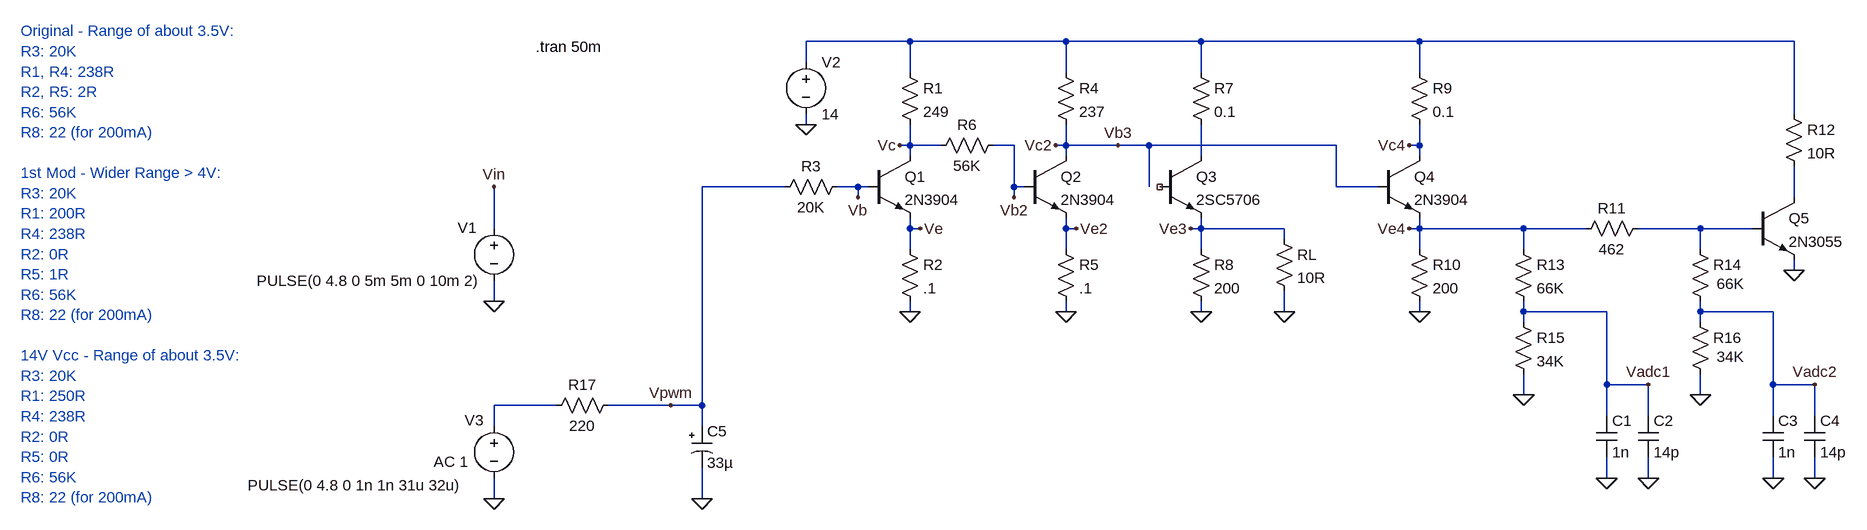
[diagram p0: schematic 2N3904 DC Amplifier - Base Driver.asc]
2N3904 DC Amplifier - Base Driver.asc, the LTspice schematic file:
Version 4
SHEET 1 2760 680
WIRE 192 -48 32 -48
WIRE 432 -48 192 -48
WIRE 640 -48 432 -48
WIRE 976 -48 640 -48
WIRE 1552 -48 976 -48
WIRE 32 -16 32 -48
WIRE 192 0 192 -48
WIRE 432 0 432 -48
WIRE 640 0 640 -48
WIRE 976 0 976 -48
WIRE 1552 64 1552 -48
WIRE 32 80 32 64
WIRE 192 112 192 80
WIRE 192 112 176 112
WIRE 240 112 192 112
WIRE 352 112 320 112
WIRE 432 112 432 80
WIRE 432 112 416 112
WIRE 512 112 432 112
WIRE 560 112 512 112
WIRE 848 112 560 112
WIRE 976 112 976 80
WIRE 976 112 960 112
WIRE 192 128 192 112
WIRE 432 128 432 112
WIRE 640 128 640 80
WIRE 976 128 976 112
WIRE 0 176 -128 176
WIRE 112 176 80 176
WIRE 128 176 112 176
WIRE 352 176 352 112
WIRE 368 176 352 176
WIRE 560 176 560 112
WIRE 848 176 848 112
WIRE 912 176 848 176
WIRE 112 192 112 176
WIRE 352 192 352 176
WIRE 1552 192 1552 144
WIRE -448 240 -448 176
WIRE 192 240 192 224
WIRE 208 240 192 240
WIRE 432 240 432 224
WIRE 448 240 432 240
WIRE 640 240 640 224
WIRE 640 240 624 240
WIRE 768 240 640 240
WIRE 976 240 976 224
WIRE 976 240 960 240
WIRE 1136 240 976 240
WIRE 1232 240 1136 240
WIRE 1408 240 1312 240
WIRE 1488 240 1408 240
WIRE 768 256 768 240
WIRE 192 272 192 240
WIRE 432 272 432 240
WIRE 640 272 640 240
WIRE 976 272 976 240
WIRE 1136 272 1136 240
WIRE 1408 272 1408 240
WIRE 1552 304 1552 288
WIRE -448 352 -448 320
WIRE 192 368 192 352
WIRE 432 368 432 352
WIRE 640 368 640 352
WIRE 768 368 768 336
WIRE 976 368 976 352
WIRE 1136 368 1136 352
WIRE 1264 368 1136 368
WIRE 1408 368 1408 352
WIRE 1520 368 1408 368
WIRE 1136 384 1136 368
WIRE 1408 384 1408 368
WIRE 1264 480 1264 368
WIRE 1328 480 1264 480
WIRE 1520 480 1520 368
WIRE 1584 480 1520 480
WIRE 1136 496 1136 464
WIRE 1408 496 1408 464
WIRE -352 512 -448 512
WIRE -176 512 -272 512
WIRE -128 512 -128 176
WIRE -128 512 -176 512
WIRE 1264 528 1264 480
WIRE 1328 528 1328 480
WIRE 1520 528 1520 480
WIRE 1584 528 1584 480
WIRE -448 544 -448 512
WIRE -128 544 -128 512
WIRE 1264 624 1264 592
WIRE 1328 624 1328 592
WIRE 1520 624 1520 592
WIRE 1584 624 1584 592
WIRE -448 656 -448 624
WIRE -128 656 -128 608
FLAG 32 80 0
FLAG -448 352 0
FLAG 192 368 0
FLAG 176 112 Vc
FLAG 208 240 Ve
FLAG 112 192 Vb
FLAG -448 176 Vin
FLAG 432 368 0
FLAG 416 112 Vc2
FLAG 448 240 Ve2
FLAG 352 192 Vb2
FLAG 640 368 0
FLAG 624 240 Ve3
FLAG 512 112 Vb3
FLAG 768 368 0
FLAG 976 368 0
FLAG 960 112 Vc4
FLAG 960 240 Ve4
FLAG 1552 304 0
FLAG 1136 496 0
FLAG 1408 496 0
FLAG 1264 624 0
FLAG 1328 624 0
FLAG 1520 624 0
FLAG 1584 624 0
FLAG 1328 480 Vadc1
FLAG 1584 480 Vadc2
FLAG -448 656 0
FLAG -128 656 0
FLAG -176 512 Vpwm
SYMBOL npn 128 128 R0
SYMATTR InstName Q1
SYMATTR Value 2N3904
SYMBOL voltage -448 224 R0
WINDOW 0 -56 15 Left 2
WINDOW 3 -365 96 Left 2
WINDOW 123 -382 125 Left 2
WINDOW 39 0 0 Left 0
SYMATTR InstName V1
SYMATTR Value PULSE(0 4.8 0 5m 5m 0 10m 2)
SYMBOL voltage 32 -32 R0
WINDOW 123 0 0 Left 0
WINDOW 39 0 0 Left 0
SYMATTR InstName V2
SYMATTR Value 14
SYMBOL res 176 -16 R0
SYMATTR InstName R1
SYMATTR Value 249
SYMBOL res 96 160 R90
WINDOW 0 0 56 VBottom 2
WINDOW 3 32 56 VTop 2
SYMATTR InstName R3
SYMATTR Value 20K
SYMBOL res 176 256 R0
SYMATTR InstName R2
SYMATTR Value .1
SYMBOL npn 368 128 R0
SYMATTR InstName Q2
SYMATTR Value 2N3904
SYMBOL res 416 -16 R0
SYMATTR InstName R4
SYMATTR Value 237
SYMBOL res 416 256 R0
SYMATTR InstName R5
SYMATTR Value .1
SYMBOL res 336 96 R90
WINDOW 0 0 56 VBottom 2
WINDOW 3 32 56 VTop 2
SYMATTR InstName R6
SYMATTR Value 56K
SYMBOL npn 576 128 R0
SYMATTR InstName Q3
SYMATTR Value 2SC5706
SYMBOL res 624 -16 R0
SYMATTR InstName R7
SYMATTR Value 0.1
SYMBOL res 624 256 R0
SYMATTR InstName R8
SYMATTR Value 200
SYMBOL res 752 240 R0
SYMATTR InstName RL
SYMATTR Value 10R
SYMBOL npn 912 128 R0
SYMATTR InstName Q4
SYMATTR Value 2N3904
SYMBOL res 960 -16 R0
SYMATTR InstName R9
SYMATTR Value 0.1
SYMBOL res 960 256 R0
SYMATTR InstName R10
SYMATTR Value 200
SYMBOL res 1328 224 R90
WINDOW 0 0 56 VBottom 2
WINDOW 3 32 56 VTop 2
SYMATTR InstName R11
SYMATTR Value 462
SYMBOL npn 1488 192 R0
SYMATTR InstName Q5
SYMATTR Value 2N3055
SYMBOL res 1536 48 R0
SYMATTR InstName R12
SYMATTR Value 10R
SYMBOL res 1120 256 R0
SYMATTR InstName R13
SYMATTR Value 66K
SYMBOL res 1392 256 R0
WINDOW 3 41 69 Left 2
SYMATTR Value 66K
SYMATTR InstName R14
SYMBOL res 1120 368 R0
SYMATTR InstName R15
SYMATTR Value 34K
SYMBOL res 1392 368 R0
WINDOW 3 41 69 Left 2
SYMATTR Value 34K
SYMATTR InstName R16
SYMBOL cap 1248 528 R0
SYMATTR InstName C1
SYMATTR Value 1n
SYMBOL cap 1312 528 R0
SYMATTR InstName C2
SYMATTR Value 14p
SYMBOL cap 1504 528 R0
SYMATTR InstName C3
SYMATTR Value 1n
SYMBOL cap 1568 528 R0
SYMATTR InstName C4
SYMATTR Value 14p
SYMBOL res -256 496 R90
WINDOW 0 0 56 VBottom 2
WINDOW 3 32 56 VTop 2
SYMATTR InstName R17
SYMATTR Value 220
SYMBOL voltage -448 528 R0
WINDOW 0 -45 7 Left 2
WINDOW 3 -379 107 Left 2
WINDOW 123 -93 71 Left 2
WINDOW 39 0 0 Left 2
SYMATTR InstName V3
SYMATTR Value PULSE(0 4.8 0 1n 1n 31u 32u)
SYMATTR Value2 AC 1
SYMBOL polcap -144 544 R0
WINDOW 3 24 56 Left 2
SYMATTR Value 33µ
SYMATTR InstName C5
SYMATTR Description Capacitor
SYMATTR Type cap
SYMATTR SpiceLine V=50 Irms=25m Rser=6.7 Lser=0
TEXT -384 -40 Left 2 !.tran 50m
TEXT -1176 -64 Left 2 ;Original - Range of about 3.5V:\nR3: 20K\nR1, R4: 238R\nR2, R5: 2R\nR6: 56K\nR8: 22 (for 200mA)\n \n1st Mod - Wider Range > 4V:\nR3: 20K\nR1: 200R\nR4: 238R\nR2: 0R\nR5: 1R\nR6: 56K\nR8: 22 (for 200mA)\n \n14V Vcc - Range of about 3.5V:\nR3: 20K\nR1: 250R\nR4: 238R\nR2: 0R\nR5: 0R\nR6: 56K\nR8: 22 (for 200mA)

The netlist it stands for:
* 2N3904 DC Amplifier - Base Driver.asc
Q1 Vc Vb Ve 0 2N3904
V1 Vin 0 PULSE(0 4.8 0 5m 5m 0 10m 2)
V2 N001 0 14
R1 N001 Vc 249
R3 Vb Vpwm 20K
R2 Ve 0 .1
Q2 Vb3 Vb2 Ve2 0 2N3904
R4 N001 Vb3 237
R5 Ve2 0 .1
R6 Vb2 Vc 56K
Q3 N002 NC_01 Ve3 0 2SC5706
R7 N001 N002 0.1
R8 Ve3 0 200
RL Ve3 0 10R
Q4 Vc4 Vb3 Ve4 0 2N3904
R9 N001 Vc4 0.1
R10 Ve4 0 200
R11 N004 Ve4 462
Q5 N003 N004 0 0 2N3055
R12 N001 N003 10R
R13 Ve4 Vadc1 66K
R14 N004 Vadc2 66K
R15 Vadc1 0 34K
R16 Vadc2 0 34K
C1 Vadc1 0 1n
C2 Vadc1 0 14p
C3 Vadc2 0 1n
C4 Vadc2 0 14p
R17 Vpwm N005 220
V3 N005 0 PULSE(0 4.8 0 1n 1n 31u 32u) AC 1
C5 Vpwm 0 33µ V=50 Irms=25m Rser=6.7 Lser=0
.model NPN NPN
.model PNP PNP
.lib standard.bjt
.tran 50m
* Original - Range of about 3.5V:
* R3: 20K
* R1, R4: 238R
* R2, R5: 2R
* R6: 56K
* R8: 22 (for 200mA)
* 1st Mod - Wider Range > 4V:
* R3: 20K
* R1: 200R
* R4: 238R
* R2: 0R
* R5: 1R
* R6: 56K
* R8: 22 (for 200mA)
* 14V Vcc - Range of about 3.5V:
* R3: 20K
* R1: 250R
* R4: 238R
* R2: 0R
* R5: 0R
* R6: 56K
* R8: 22 (for 200mA)
.backanno
.end